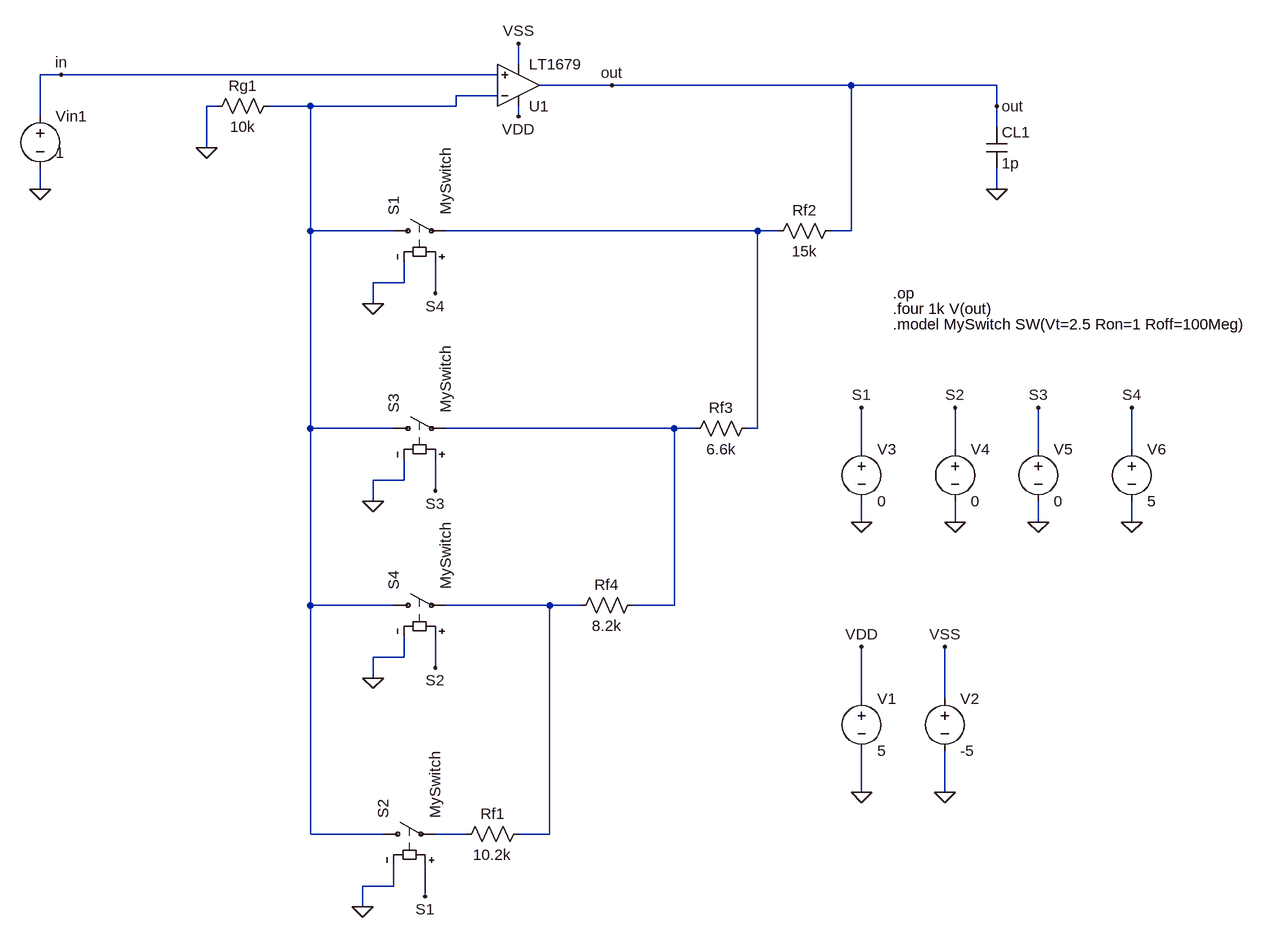
[diagram p0: schematic Etaj_3_PGA_op.asc]
Etaj_3_PGA_op.asc, the LTspice schematic file:
Version 4.1
SHEET 1 1460 828
WIRE 288 -528 288 -560
WIRE -416 -512 -448 -512
WIRE 256 -512 -416 -512
WIRE 432 -496 320 -496
WIRE 800 -496 432 -496
WIRE 1024 -496 800 -496
WIRE 256 -480 192 -480
WIRE -176 -464 -192 -464
WIRE -32 -464 -96 -464
WIRE 192 -464 192 -480
WIRE 192 -464 -32 -464
WIRE 1024 -464 1024 -496
WIRE -448 -448 -448 -512
WIRE 288 -448 288 -464
WIRE 1024 -432 1024 -464
WIRE -192 -400 -192 -464
WIRE -448 -336 -448 -368
WIRE 1024 -336 1024 -368
WIRE -32 -272 -32 -464
WIRE 96 -272 -32 -272
WIRE 656 -272 176 -272
WIRE 688 -272 656 -272
WIRE 800 -272 800 -496
WIRE 800 -272 768 -272
WIRE 112 -192 112 -224
WIRE 112 -192 64 -192
WIRE 160 -176 160 -224
WIRE 64 -160 64 -192
WIRE -32 32 -32 -272
WIRE 96 32 -32 32
WIRE 528 32 176 32
WIRE 560 32 528 32
WIRE 656 32 656 -272
WIRE 656 32 640 32
WIRE 816 64 816 0
WIRE 960 64 960 0
WIRE 1088 64 1088 0
WIRE 1232 64 1232 0
WIRE 112 112 112 80
WIRE 112 112 64 112
WIRE 160 128 160 80
WIRE 64 144 64 112
WIRE 816 176 816 144
WIRE 960 176 960 144
WIRE 1088 176 1088 144
WIRE 1232 176 1232 144
WIRE -32 304 -32 32
WIRE 96 304 -32 304
WIRE 336 304 176 304
WIRE 384 304 336 304
WIRE 528 304 528 32
WIRE 528 304 464 304
WIRE 112 384 112 352
WIRE 112 384 64 384
WIRE 160 400 160 352
WIRE 64 416 64 384
WIRE 816 448 816 368
WIRE 944 448 944 368
WIRE 816 592 816 528
WIRE 944 592 944 528
WIRE -32 656 -32 304
WIRE 80 656 -32 656
WIRE 208 656 160 656
WIRE 336 656 336 304
WIRE 336 656 288 656
WIRE 96 736 96 704
WIRE 96 736 48 736
WIRE 144 752 144 704
WIRE 48 768 48 736
FLAG 816 592 0
FLAG 816 368 VDD
FLAG -448 -336 0
FLAG -192 -400 0
FLAG 432 -496 out
FLAG 288 -448 VDD
FLAG 288 -560 VSS
FLAG 1024 -336 0
FLAG -416 -512 in
FLAG 944 592 0
FLAG 944 368 VSS
FLAG 144 752 S1
FLAG 64 -160 0
FLAG 160 400 S2
FLAG 64 144 0
FLAG 160 128 S3
FLAG 64 416 0
FLAG 160 -176 S4
FLAG 48 768 0
FLAG 816 176 0
FLAG 816 0 S1
FLAG 960 176 0
FLAG 960 0 S2
FLAG 1088 176 0
FLAG 1088 0 S3
FLAG 1232 176 0
FLAG 1232 0 S4
FLAG 1024 -464 out
DATAFLAG 80 -464 ""
DATAFLAG 688 -496 ""
DATAFLAG 912 -496 ""
SYMBOL voltage 816 432 R0
WINDOW 123 0 0 Left 2
WINDOW 39 0 0 Left 2
SYMATTR InstName V1
SYMATTR Value 5
SYMBOL res -80 -480 R90
WINDOW 0 0 56 VBottom 2
WINDOW 3 32 56 VTop 2
SYMATTR InstName Rg1
SYMATTR Value 10k
SYMBOL res 304 640 R90
WINDOW 0 0 56 VBottom 2
WINDOW 3 32 56 VTop 2
SYMATTR InstName Rf1
SYMATTR Value 10.2k
SYMBOL voltage -448 -464 R0
WINDOW 123 24 44 Left 2
WINDOW 39 0 0 Left 2
WINDOW 3 24 72 Left 2
SYMATTR Value 1
SYMATTR InstName Vin1
SYMBOL res 784 -288 R90
WINDOW 0 0 56 VBottom 2
WINDOW 3 32 56 VTop 2
SYMATTR InstName Rf2
SYMATTR Value 15k
SYMBOL res 656 16 R90
WINDOW 0 0 56 VBottom 2
WINDOW 3 32 56 VTop 2
SYMATTR InstName Rf3
SYMATTR Value 6.6k
SYMBOL res 480 288 R90
WINDOW 0 0 56 VBottom 2
WINDOW 3 32 56 VTop 2
SYMATTR InstName Rf4
SYMATTR Value 8.2k
SYMBOL cap 1008 -432 R0
SYMATTR InstName CL1
SYMATTR Value 1p
SYMBOL OpAmps\\LT1679 288 -496 M180
SYMATTR InstName U1
SYMBOL voltage 944 432 R0
WINDOW 123 0 0 Left 2
WINDOW 39 0 0 Left 2
SYMATTR InstName V2
SYMATTR Value -5
SYMBOL voltage 816 48 R0
WINDOW 123 0 0 Left 2
WINDOW 39 0 0 Left 2
SYMATTR InstName V3
SYMATTR Value 0
SYMBOL voltage 960 48 R0
WINDOW 123 0 0 Left 2
WINDOW 39 0 0 Left 2
SYMATTR InstName V4
SYMATTR Value 0
SYMBOL voltage 1088 48 R0
WINDOW 123 0 0 Left 2
WINDOW 39 0 0 Left 2
SYMATTR InstName V5
SYMATTR Value 0
SYMBOL voltage 1232 48 R0
WINDOW 123 0 0 Left 2
WINDOW 39 0 0 Left 2
SYMATTR InstName V6
SYMATTR Value 5
SYMBOL sw 80 -272 R270
SYMATTR InstName S1
SYMATTR Value MySwitch
SYMBOL sw 64 656 R270
SYMATTR InstName S2
SYMATTR Value MySwitch
SYMBOL sw 80 32 R270
SYMATTR InstName S3
SYMATTR Value MySwitch
SYMBOL sw 80 304 R270
SYMATTR InstName S4
SYMATTR Value MySwitch
TEXT 864 -176 Left 2 !.op
TEXT 864 -128 Left 2 !.model MySwitch SW(Vt=2.5 Ron=1 Roff=100Meg)
TEXT 864 -152 Left 2 !.four 1k V(out)

The netlist it stands for:
* Etaj_3_PGA_op.asc
V1 VDD 0 5
Rg1 N001 0 10k
Rf1 N004 N005 10.2k
Vin1 in 0 1
Rf2 out N002 15k
Rf3 N002 N003 6.6k
Rf4 N003 N004 8.2k
CL1 out 0 1p
* U1: LT1679 (symbol OpAmps\LT1679 not available, pins judged from their places): In+=in In-=N001 V+=VDD V-=VSS OUT=out
V2 VSS 0 -5
V3 S1 0 0
V4 S2 0 0
V5 S3 0 0
V6 S4 0 5
S1 N001 N002 S4 0 MySwitch
S2 N001 N005 S1 0 MySwitch
S3 N001 N003 S3 0 MySwitch
S4 N001 N004 S2 0 MySwitch
.op
.model MySwitch SW(Vt=2.5 Ron=1 Roff=100Meg)
.four 1k V(out)
.backanno
.end